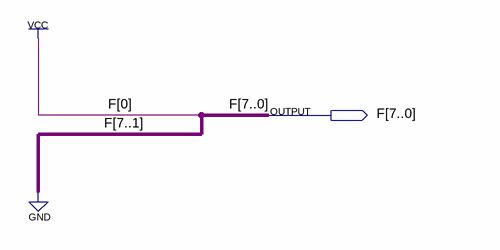
[diagram p0: schematic sheet]
// Quartus schematic staticOne.bdf as structural Verilog: 0 symbols, 1 pins
module staticOne (
  output [7:0] F
);


  assign F = 8'b00000001;
endmodule
